# EAGLE design xlr blinker board (EAGLE 6.3)
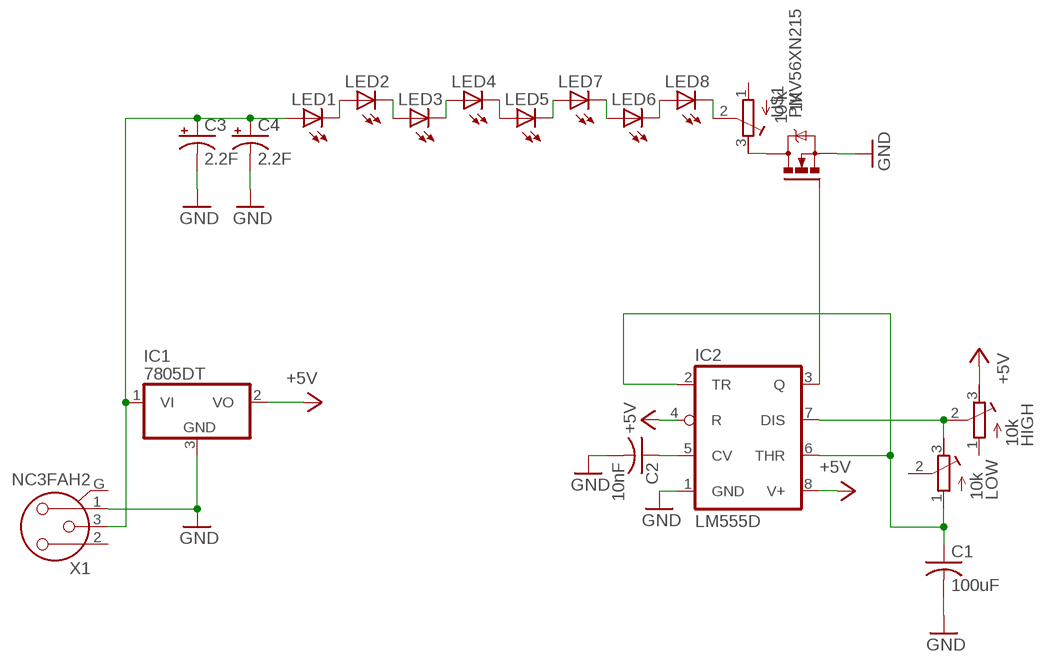
[diagram p0: schematic, sheet 1]

## Parts
1K  10 k  R-TRIMM3314J  [RTRIM3314J]
C1  100uF  C-USC1206  [C1206]
C2  10nF  C-USC1206  [C1206]
C3  2.2F  CPOL-USE5-10.5  [E5-10,5]
C4  2.2F  CPOL-USE5-10.5  [E5-10,5]
HIGH  10k  R-TRIMM3314J  [RTRIM3314J]
IC1  7805DT  [TO252]
IC2  LM555D  [SO08]
LED1  LEDCHIPLED_1206  [CHIPLED_1206]
LED2  LEDCHIPLED_1206  [CHIPLED_1206]
LED3  LEDCHIPLED_1206  [CHIPLED_1206]
LED4  LEDCHIPLED_1206  [CHIPLED_1206]
LED5  LEDCHIPLED_1206  [CHIPLED_1206]
LED6  LEDCHIPLED_1206  [CHIPLED_1206]
LED7  LEDCHIPLED_1206  [CHIPLED_1206]
LED8  LEDCHIPLED_1206  [CHIPLED_1206]
LOW  10k  R-TRIMM3314J  [RTRIM3314J]
U$1  PMV56XN215  N-CHANNEL_MOSFETPMV56XN,215  [SOT23]
X1  NC3FAH2  [NC3FAH2]

## Nets
24V: C3.+ C4.+ IC1.1(VI) LED1.A X1.3
+5V: HIGH.3(A) IC1.2(VO) IC2.4(R) IC2.8(V+)
GND: C1.2 C2.2 C3.- C4.- IC1.3(GND) IC2.1(GND) U$1.2(S) X1.1
N$1: HIGH.2(S) IC2.7(DIS) LOW.3(A)
N$2: C1.1 IC2.2(TR) IC2.6(THR) LOW.1(E)
N$3: C2.1 IC2.5(CV)
N$4: 1K.2(S) LED8.C
N$5: LED1.C LED2.A
N$6: 1K.3(A) U$1.3(D)
N$7: IC2.3(Q) U$1.1(G)
N$8: LED2.C LED3.A
N$10: LED3.C LED4.A
N$11: LED4.C LED5.A
N$12: LED5.C LED7.A
N$13: LED6.A LED7.C
N$14: LED6.C LED8.A
Unconnected: 1K.1(E) HIGH.1(E) LOW.2(S) X1.2 X1.G

## Library data of the parts
1K HIGH LOW = resistor:R-TRIMM: Trimm resistor
C1 C2 = rcl:C-US: CAPACITOR, American symbol
C3 C4 = rcl:CPOL-US: POLARIZED CAPACITOR, American symbol
IC1 = linear:78*: Positive VOLTAGE REGULATOR Source: http://cache.national.com/ds/LM/LM78L05.pdf http://www.fairchildsemi.com/ds/LM/LM7805.pdf
IC2 = linear:*555: TIMER
LED1-LED8 = led:LED: LED OSRAM: - CHIPLED LG R971, LG N971, LY N971, LG Q971, LY Q971, LO R971, LY R971 LH N974, LH R974 LS Q976, LO Q976, LY Q976 LO Q996 - Hyper CHIPLED LW Q18S LB Q993, LB Q99A, LB R99A - SideLED LS A670, LO A670, LY A670, LG A670, LP A670 LB A673, LV A673, LT A673, LW A673 LH A674 LY A675 LS A676, LA A676, LO A676, LY A676, LW A676 LS A679, LY A679, LG A679 - Hyper Micro SIDELED® LS Y876, LA Y876, LO Y876, LY Y876 LT Y87S - SmartLED LW L88C, LW L88S LB L89C, LB L89S, LG L890 LS L89K, LO L89K, LY L89K LS L896, LA L896, LO L896, LY L896 - TOPLED LS T670, LO T670, LY T670, LG T670, LP T670 LSG T670, LSP T670, LSY T670, LOP T670, LYG T670 LG T671, LOG T671, LSG T671 LB T673, LV T673, LT T673, LW T673 LH T674 LS T676, LA T676, LO T676, LY T676, LB T676, LH T676, LSB T676, LW T676 LB T67C, LV T67C, LT T67C, LS T67K, LO T67K, LY T67K, LW E67C LS E67B, LA E67B, LO E67B, LY E67B, LB E67C, LV E67C, LT E67C LW T67C LS T679, LY T679, LG T679 LS T770, LO T770, LY T770, LG T770, LP T770 LB T773, LV T773, LT T773, LW T773 LH T774 LS E675, LA E675, LY E675, LS T675 LS T776, LA T776, LO T776, LY T776, LB T776 LHGB T686 LT T68C, LB T68C - Hyper Mini TOPLED® LB M676 - Mini TOPLED Santana® LG M470 LS M47K, LO M47K, LY M47K Source: http://www.osram.convergy.de LUXEON: - LUMILED® LXK2-PW12-R00, LXK2-PW12-S00, LXK2-PW14-U00, LXK2-PW14-V00 LXK2-PM12-R00, LXK2-PM12-S00, LXK2-PM14-U00 LXK2-PE12-Q00, LXK2-PE12-R00, LXK2-PE12-S00, LXK2-PE14-T00, LXK2-PE14-U00 LXK2-PB12-K00, LXK2-PB12-L00, LXK2-PB12-M00, LXK2-PB14-N00, LXK2-PB14-P00, LXK2-PB14-Q00 LXK2-PR12-L00, LXK2-PR12-M00, LXK2-PR14-Q00, LXK2-PR14-R00 LXK2-PD12-Q00, LXK2-PD12-R00, LXK2-PD12-S00 LXK2-PH12-R00, LXK2-PH12-S00 LXK2-PL12-P00, LXK2-PL12-Q00, LXK2-PL12-R00 Source: www.luxeon.com KINGBRIGHT: KA-3528ASYC Source: www.kingbright.com
U$1 = SolarJacketsADC:N-CHANNEL_MOSFET; PART_NUM: PMV56XN,215
X1 = con-neutrik_ag:NC3: Neutrik Audio Connector XLR SERIES Stereo 1/4" jack Source: www.neutrik.com/; MPN: NC3FAH2; OC_FARNELL: unknown; OC_NEWARK: 27B4208

## Board
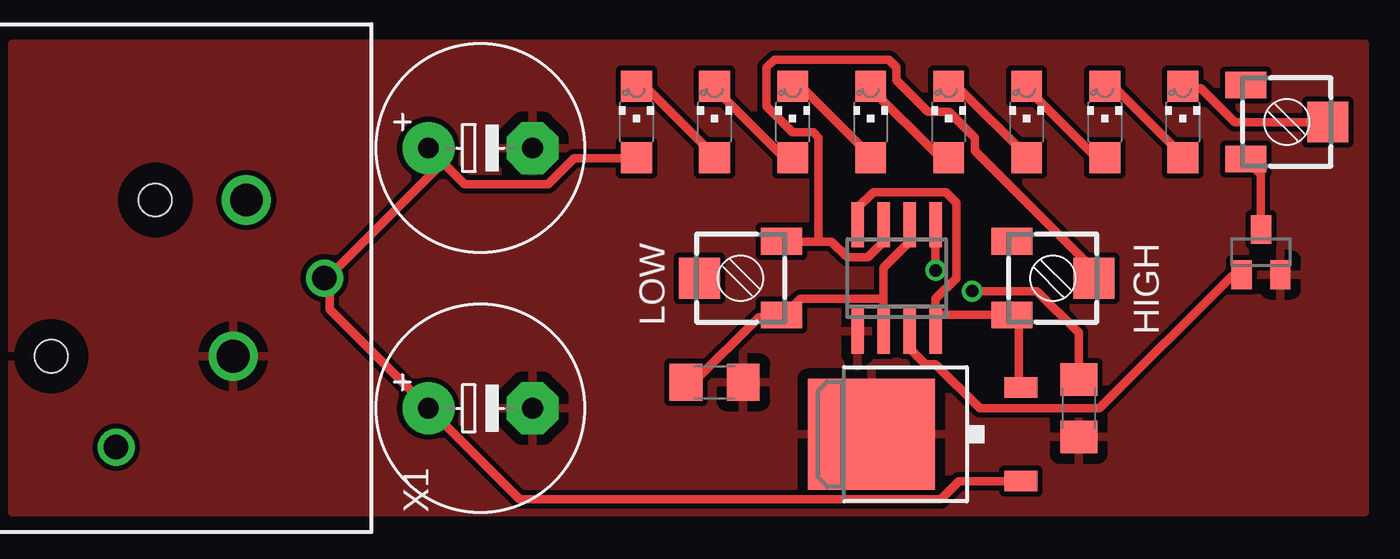
[diagram p1: board, top side]
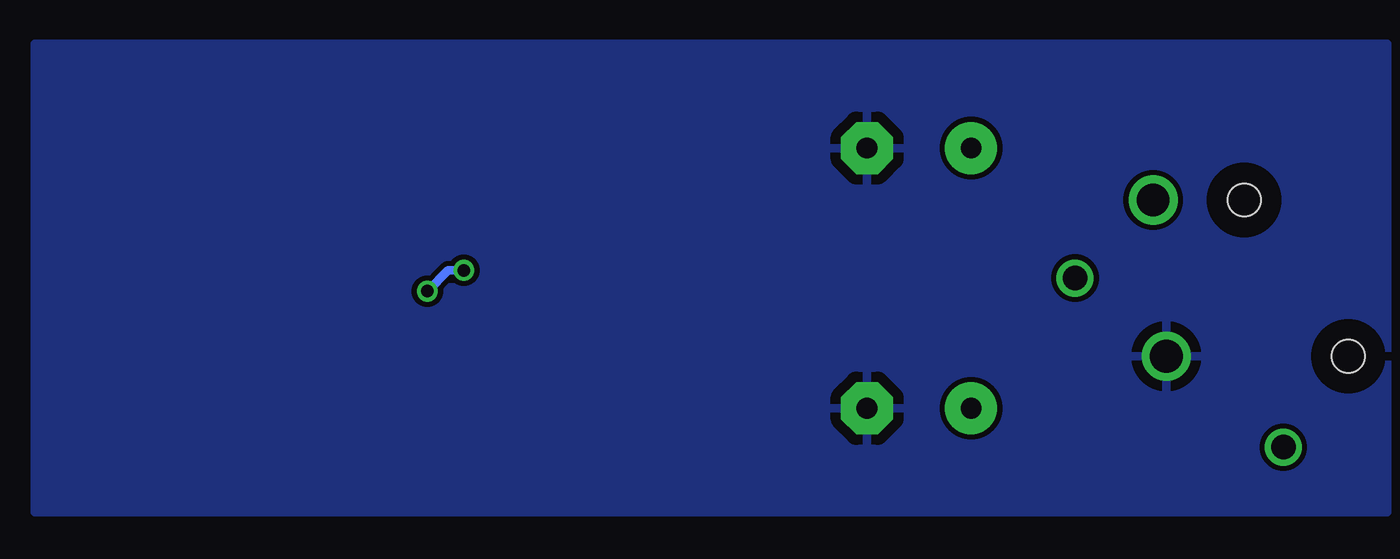
[diagram p2: board, bottom side, seen from below]

No outline drawn. Coordinates in mm, seen from the top.
Copper layers (1*16): Top 0.035mm / dielectric 1.5mm / Bottom 0.035mm
Design rules "SJ Design Rules": minimum track width 16mil, minimum drill 24mil, track to track 10mil, track to pad 10mil, pad to pad 10mil, via to via 10mil, smd to smd 10mil, copper to edge 40mil, drill to drill 10mil, minimum pad ring 10mil, minimum via ring 8mil, stop-mask expansion 4mil, vias tented up to drill 0mil, thermal gap 20mil

### Footprints (pad centres in the part's own frame; a part is rotated, then mirrored left to right if it is on the bottom)
RTRIM3314J = smd 1.3 x 2: 1 -1.8,-2; 3 1.8,-2 | smd 2 x 2: 2 0,2
C1206 = smd 1.6 x 1.8: 1 -1.4,0; 2 1.4,0
E5-10,5 = drill 1.016 pad 2.54: + -2.54,0 | drill 1.016 pad 2.54 octagon: - 2.54,0
TO252 = smd 1 x 1.6: 1 -2.28,-4.8; 2 2.28,-4.8 | smd 5.4 x 6.2: 3 0,2.5
SO08 = smd 0.6 x 2.2: 1 -1.905,-2.6; 2 -0.635,-2.6; 3 0.635,-2.6; 4 1.905,-2.6; 5 1.905,2.6; 6 0.635,2.6; 7 -0.635,2.6; 8 -1.905,2.6
CHIPLED_1206 = smd 1.5 x 1.5: A 0,-1.75; C 0,1.75
SOT23 = smd 1 x 1.4: 1 -0.95,-1.1; 2 0.95,-1.1; 3 0,1.1
NC3FAH2 = drill 1.6: 1 -3.81,0.635; 2 3.81,0 | drill 1.2: 3 0,-3.815; G -8.25,6.355 | hole 1.6: -3.81,9.525; 3.81,4.445

### Placement (x,y rotation side)
1K  63.5,20.32 270 top
C1  35.56,7.62 0 top
C2  53.34,6.35 270 top
C3  24.13,19.05 0 top
C4  24.13,6.35 0 top
HIGH  52.07,12.7 270 top
IC1  45.72,5.08 90 top
IC2  44.45,12.7 0 top
LED1  31.75,20.32 0 top
LED2  35.56,20.32 0 top
LED3  39.37,20.32 0 top
LED4  43.18,20.32 0 top
LED5  46.99,20.32 0 top
LED6  54.61,20.32 0 top
LED7  50.8,20.32 0 top
LED8  58.42,20.32 0 top
LOW  36.83,12.7 90 top
U$1  62.23,13.97 0 top
X1  12.7,12.7 90 top

### Tracks (layer width: path | path; a pad name or v marks a point on that pad's centre or on a via)
24V
  Top 0.406: LED1.A 31.75,18.54 28.7,18.54 27.43,17.27 23.37,17.27 C3.+ 22.23,18.29 16.64,12.7 X1.3 16.76,12.57 16.76,11.18 C4.+ 26.04,1.91 46.61,1.91 47.5,2.79 50.42,2.79 IC1.1
+5V
  Top 0.406: IC1.2 50.42,7.37 50.42,10.54 50.16,10.79 HIGH.3 49.91,10.92 46.48,10.92 IC2.4 46.35,11.68 47.37,12.7 47.37,16.38 46.86,16.89 43.31,16.89 42.55,16.13 IC2.8
GND
  pour Bottom: 1.27,24.13 1.27,1.27 67.31,1.27 67.31,24.13
  pour Top: 1.27,24.13 1.27,1.27 67.31,1.27 67.31,24.13
N$1
  Top 0.406: 40.64,14.48 41.27,14.48 42.04,13.72 43.05,13.72 43.81,14.48 IC2.7 | 40.64,14.48 38.86,14.48 LOW.3 | 40.64,14.48 40.64,19.56 40.39,19.81 39.37,19.81 38.1,21.08 38.1,22.99 38.48,23.37 44.07,23.37 44.45,22.99 44.45,22.35 45.97,20.83 46.99,20.83 48.26,19.56 48.26,18.92 53.98,13.21 53.98,12.7 HIGH.2
N$2
  Top 0.406: 43.81,11.68 43.81,13.21 45.09,14.48 IC2.6 | 43.81,11.68 IC2.2 | C1.1 34.54,7.62 37.72,10.79 38.73,10.79 LOW.1 38.99,10.92 39.75,11.68 43.81,11.68
N$3  (via drill 0.61)
  Top 0.406: C2.1 53.34,10.03 51.31,12.06 v48.13,12.06 | IC2.5 v46.35,13.08
  Bottom 0.406: v48.13,12.06 47.12,13.08 v46.35,13.08
N$4
  Top 0.406: 1K.2 60.96,20.32 59.31,21.97 58.42,21.97 LED8.C
N$5
  Top 0.406: LED1.C 31.75,21.97 32.26,21.97 35.56,18.67 LED2.A
N$6
  Top 0.406: U$1.3 62.23,17.78 61.59,18.41 1K.3
N$7
  Top 0.406: IC2.3 45.09,9.27 45.85,8.51 46.35,8.51 48.51,6.35 54.36,6.35 60.83,12.83 61.21,12.83 U$1.1
N$8
  Top 0.406: LED3.A 39.37,18.67 38.86,18.67 35.56,21.97 LED2.C
N$10
  Top 0.406: LED3.C 39.37,21.97 39.88,21.97 43.18,18.67 LED4.A
N$11
  Top 0.406: LED5.A 46.99,18.67 46.48,18.67 43.18,21.97 LED4.C
N$12
  Top 0.406: LED5.C 46.99,21.97 47.5,21.97 50.8,18.67 LED7.A
N$13
  Top 0.406: LED6.A 54.61,18.67 54.1,18.67 50.8,21.97 LED7.C
N$14
  Top 0.406: LED6.C 54.61,21.97 55.12,21.97 58.42,18.67 LED8.A